# EAGLE design mach nguon doi (EAGLE 5.07)
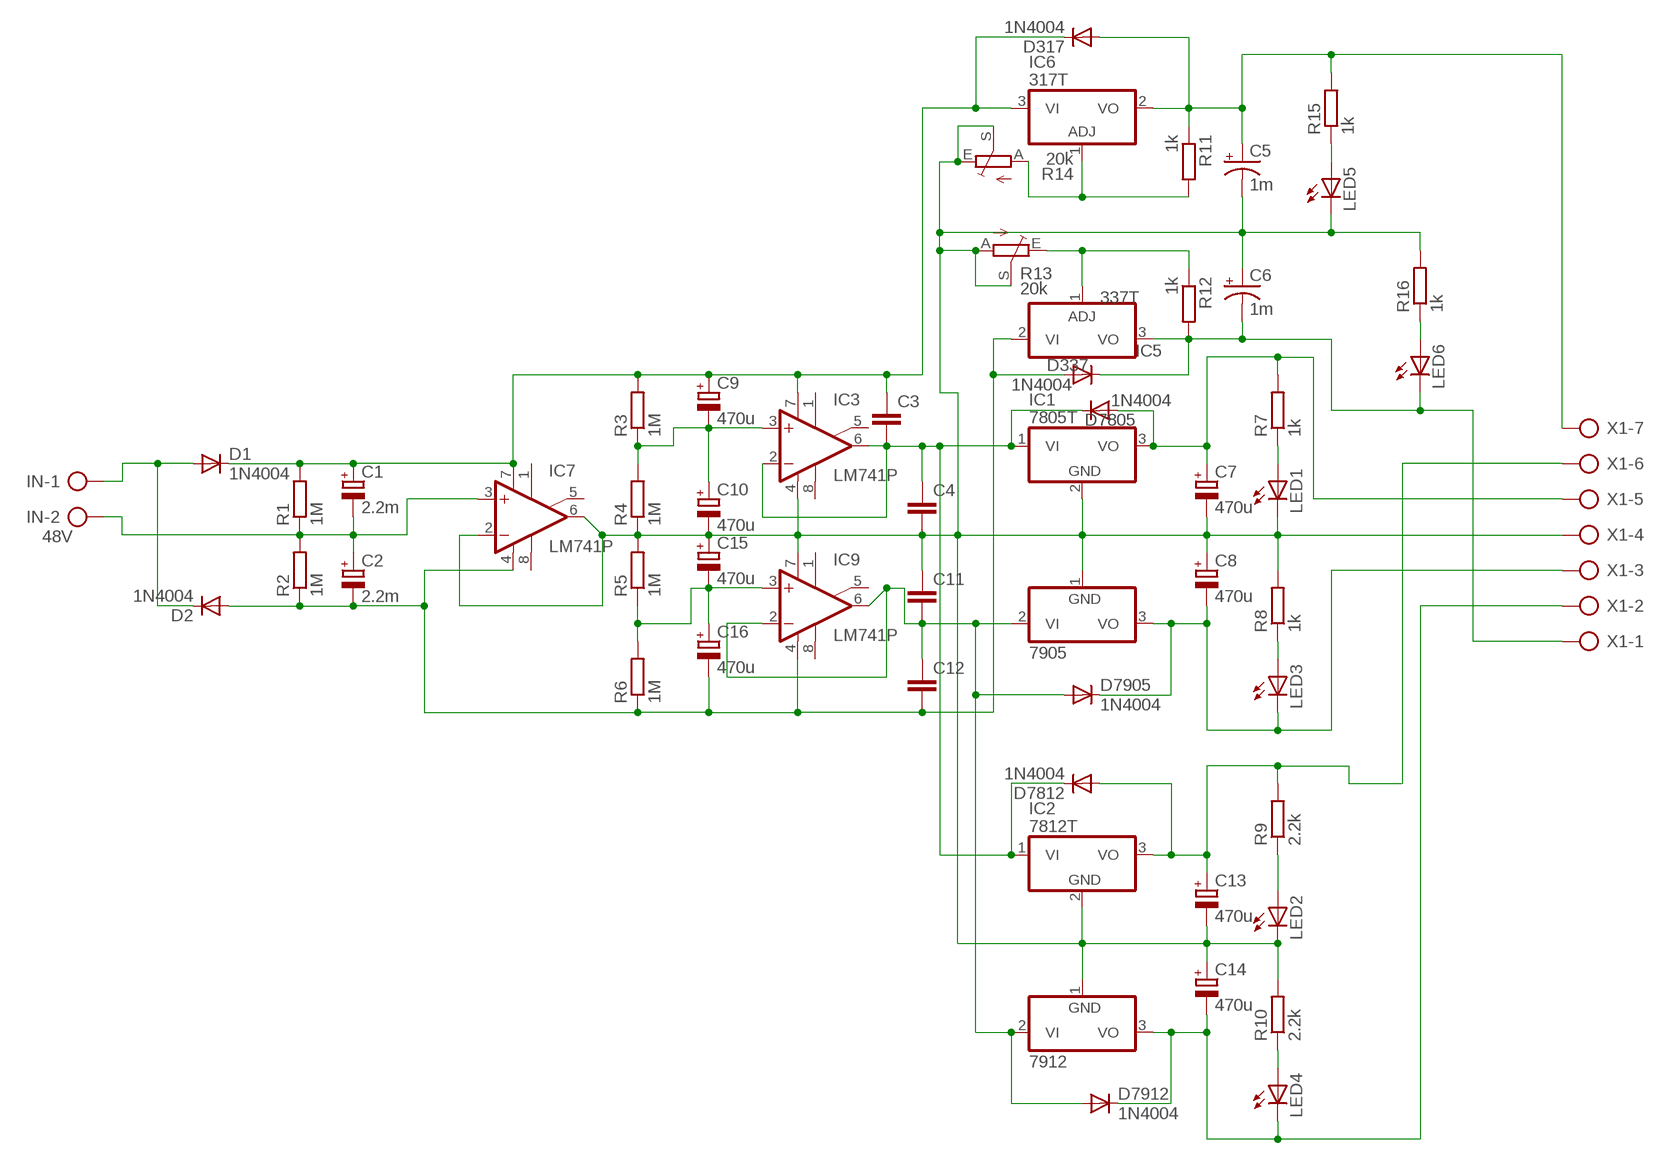
[diagram p0: schematic, sheet 1]

## Parts
7905  7905T  [TO220H]
7912  7912T  [TO220H]
C1  2.2m  CPOL-EUE7.5-18  [E7,5-18]
C2  2.2m  CPOL-EUE7.5-18  [E7,5-18]
C3  C-EU050-035X075  [C050-035X075]
C4  C-EU050-035X075  [C050-035X075]
C5  1m  CPOL-USE5-13  [E5-13]
C6  1m  CPOL-USE5-13  [E5-13]
C7  470u  CPOL-EUE5-8.5  [E5-8,5]
C8  470u  CPOL-EUE5-8.5  [E5-8,5]
C9  470u  CPOL-EUE5-8.5  [E5-8,5]
C10  470u  CPOL-EUE5-8.5  [E5-8,5]
C11  C-EU050-035X075  [C050-035X075]
C12  C-EU050-035X075  [C050-035X075]
C13  470u  CPOL-EUE5-8.5  [E5-8,5]
C14  470u  CPOL-EUE5-8.5  [E5-8,5]
C15  470u  CPOL-EUE5-8.5  [E5-8,5]
C16  470u  CPOL-EUE5-8.5  [E5-8,5]
D1  1N4004  [DO41-10]
D2  1N4004  [DO41-10]
D317  1N4004  [DO41-10]
D337  1N4004  [DO41-10]
D7805  1N4004  [DO41-10]
D7812  1N4004  [DO41-10]
D7905  1N4004  [DO41-10]
D7912  1N4004  [DO41-10]
IC1  7805T  [TO220H]
IC2  7812T  [TO220H]
IC3  LM741P  [DIL08]
IC5  337T  [TO220H]
IC6  317T  [TO220H]
IC7  LM741P  [DIL08]
IC9  LM741P  [DIL08]
IN  48V  AK500/2-H  [AK500/2-H]
LED1  LED5MM  [LED5MM]
LED2  LED5MM  [LED5MM]
LED3  LED5MM  [LED5MM]
LED4  LED5MM  [LED5MM]
LED5  LED5MM  [LED5MM]
LED6  LED5MM  [LED5MM]
R1  1M  R-EU_0207/5V  [0207/5V]
R2  1M  R-EU_0207/5V  [0207/5V]
R3  1M  R-EU_0207/5V  [0207/5V]
R4  1M  R-EU_0207/5V  [0207/5V]
R5  1M  R-EU_0207/5V  [0207/5V]
R6  1M  R-EU_0207/5V  [0207/5V]
R7  1k  R-EU_0207/5V  [0207/5V]
R8  1k  R-EU_0207/5V  [0207/5V]
R9  2.2k  R-EU_0207/5V  [0207/5V]
R10  2.2k  R-EU_0207/5V  [0207/5V]
R11  1k  R-EU_0207/5V  [0207/5V]
R12  1k  R-EU_0207/5V  [0207/5V]
R13  20k  TRIM_EU-RJ9W  [RJ9W]
R14  20k  TRIM_EU-RJ9W  [RJ9W]
R15  1k  R-EU_0207/5V  [0207/5V]
R16  1k  R-EU_0207/5V  [0207/5V]
X1  AK500/7-H  [AK500/7-H]

## Nets
N$1: C1.+ C3.1 C9.+ D1.C D317.C IC3.7(V+) IC6.3(VI) IC7.7(V+) R1.2 R3.2
N$3: D1.A D2.C IN.1
N$4: C6.- D337.C IC5.3(VO) LED6.K(C) R12.2 X1.1
N$5: 7905.2(VI) 7912.2(VI) C11.2 C12.1 D7905.A D7912.A IC9.2(-IN) IC9.6(OUT)
N$6: LED1.A R7.1
N$7: C9.- C10.+ IC3.3(+IN) R3.1 R4.2
N$8: C7.+ D7805.A IC1.3(VO) R7.2 X1.5
N$9: C5.+ D317.A IC6.2(VO) R11.1 R15.2 X1.7
N$10: 7905.3(VO) C8.- D7905.C LED3.K(C) X1.3
N$11: C15.- C16.+ IC9.3(+IN) R5.1 R6.2
N$12: C2.- C12.2 C16.- D2.A D337.A IC5.2(VI) IC7.4(V-) IC9.4(V-) R2.1 R6.1
N$13: IC6.1(ADJ) R11.2 R14.A
N$14: LED3.A R8.1
N$15: 7905.1(GND) 7912.1(GND) C4.2 C5.- C6.+ C7.- C8.+ C10.- C11.1 C13.- C14.+ C15.+ IC1.2(GND) IC2.2(GND) IC3.4(V-) IC7.2(-IN) IC7.6(OUT) IC9.7(V+) LED1.K(C) LED2.K(C) LED5.K(C) R4.1 R5.2 R8.2 R10.2 R13.A R13.S R14.E R14.S R16.2 X1.4
N$16: C13.+ D7812.A IC2.3(VO) R9.2 X1.6
N$18: C1.- C2.+ IC7.3(+IN) IN.2 R1.1 R2.2
N$19: LED2.A R9.1
N$20: LED4.A R10.1
N$22: C3.2 C4.1 D7805.C D7812.C IC1.1(VI) IC2.1(VI) IC3.2(-IN) IC3.6(OUT)
N$23: IC5.1(ADJ) R12.1 R13.E
N$25: LED5.A R15.1
N$26: 7912.3(VO) C14.- D7912.C LED4.K(C) X1.2
N$28: LED6.A R16.1
Unconnected: IC3.1(ON1) IC3.5(ON2) IC3.8(OPT) IC7.1(ON1) IC7.5(ON2) IC7.8(OPT) IC9.1(ON1) IC9.5(ON2) IC9.8(OPT)

## Library data of the parts
7905 7912 = linear:79*: Negative VOLTAGE REGULATOR
C1 C2 C7-C10 C13-C16 = resistor:CPOL-EU: POLARIZED CAPACITOR, European symbol
C3 C4 C11 C12 = rcl:C-EU: CAPACITOR, European symbol
C5 C6 = rcl:CPOL-US: POLARIZED CAPACITOR, American symbol
D1 D2 D317 D337 D7805 D7812 D7905 D7912 = diode:1N4004: DIODE general purpose rectifier, 1 A
IC1 IC2 = linear:78*: Positive VOLTAGE REGULATOR Source: http://cache.national.com/ds/LM/LM78L05.pdf http://www.fairchildsemi.com/ds/LM/LM7805.pdf
IC3 IC7 IC9 = linear:*741: OP AMP
IC5 = linear:*337: Negative VOLTAGE REGULATOR
IC6 = linear:*317: Positive VOLTAGE REGULATOR
IN = con-ptr500:AK500/2-H: CONNECTOR Aug. 2004 / PTR Meßtechnik: Die Bezeichnung der Serie AK505 wurde geändert. Es handelt sich hierbei um AK500 in horizontaler Ausführung.
LED1-LED6 = led:LED: LED OSRAM: - CHIPLED LG R971, LG N971, LY N971, LG Q971, LY Q971, LO R971, LY R971 LH N974, LH R974 LS Q976, LO Q976, LY Q976 LO Q996 - Hyper CHIPLED LW Q18S LB Q993, LB Q99A, LB R99A - SideLED LS A670, LO A670, LY A670, LG A670, LP A670 LB A673, LV A673, LT A673, LW A673 LH A674 LY A675 LS A676, LA A676, LO A676, LY A676, LW A676 LS A679, LY A679, LG A679 - Hyper Micro SIDELED® LS Y876, LA Y876, LO Y876, LY Y876 LT Y87S - SmartLED LW L88C, LW L88S LB L89C, LB L89S, LG L890 LS L89K, LO L89K, LY L89K LS L896, LA L896, LO L896, LY L896 - TOPLED LS T670, LO T670, LY T670, LG T670, LP T670 LSG T670, LSP T670, LSY T670, LOP T670, LYG T670 LG T671, LOG T671, LSG T671 LB T673, LV T673, LT T673, LW T673 LH T674 LS T676, LA T676, LO T676, LY T676, LB T676, LH T676, LSB T676, LW T676 LB T67C, LV T67C, LT T67C, LS T67K, LO T67K, LY T67K, LW E67C LS E67B, LA E67B, LO E67B, LY E67B, LB E67C, LV E67C, LT E67C LW T67C LS T679, LY T679, LG T679 LS T770, LO T770, LY T770, LG T770, LP T770 LB T773, LV T773, LT T773, LW T773 LH T774 LS E675, LA E675, LY E675, LS T675 LS T776, LA T776, LO T776, LY T776, LB T776 LHGB T686 LT T68C, LB T68C - Hyper Mini TOPLED® LB M676 - Mini TOPLED Santana® LG M470 LS M47K, LO M47K, LY M47K Source: http://www.osram.convergy.de LUXEON: - LUMILED® LXK2-PW12-R00, LXK2-PW12-S00, LXK2-PW14-U00, LXK2-PW14-V00 LXK2-PM12-R00, LXK2-PM12-S00, LXK2-PM14-U00 LXK2-PE12-Q00, LXK2-PE12-R00, LXK2-PE12-S00, LXK2-PE14-T00, LXK2-PE14-U00 LXK2-PB12-K00, LXK2-PB12-L00, LXK2-PB12-M00, LXK2-PB14-N00, LXK2-PB14-P00, LXK2-PB14-Q00 LXK2-PR12-L00, LXK2-PR12-M00, LXK2-PR14-Q00, LXK2-PR14-R00 LXK2-PD12-Q00, LXK2-PD12-R00, LXK2-PD12-S00 LXK2-PH12-R00, LXK2-PH12-S00 LXK2-PL12-P00, LXK2-PL12-Q00, LXK2-PL12-R00 Source: www.luxeon.com KINGBRIGHT: KA-3528ASYC Source: www.kingbright.com
R1-R12 R15 R16 = resistor:R-EU_: RESISTOR, European symbol
R13 R14 = pot:TRIM_EU-: POTENTIOMETER
X1 = con-ptr500:AK500/7-H: CONNECTOR Aug. 2004 / PTR Meßtechnik: Die Bezeichnung der Serie AK505 wurde geändert. Es handelt sich hierbei um AK500 in horizontaler Ausführung.

## Net classes
0 default: width 2 mm

## Board
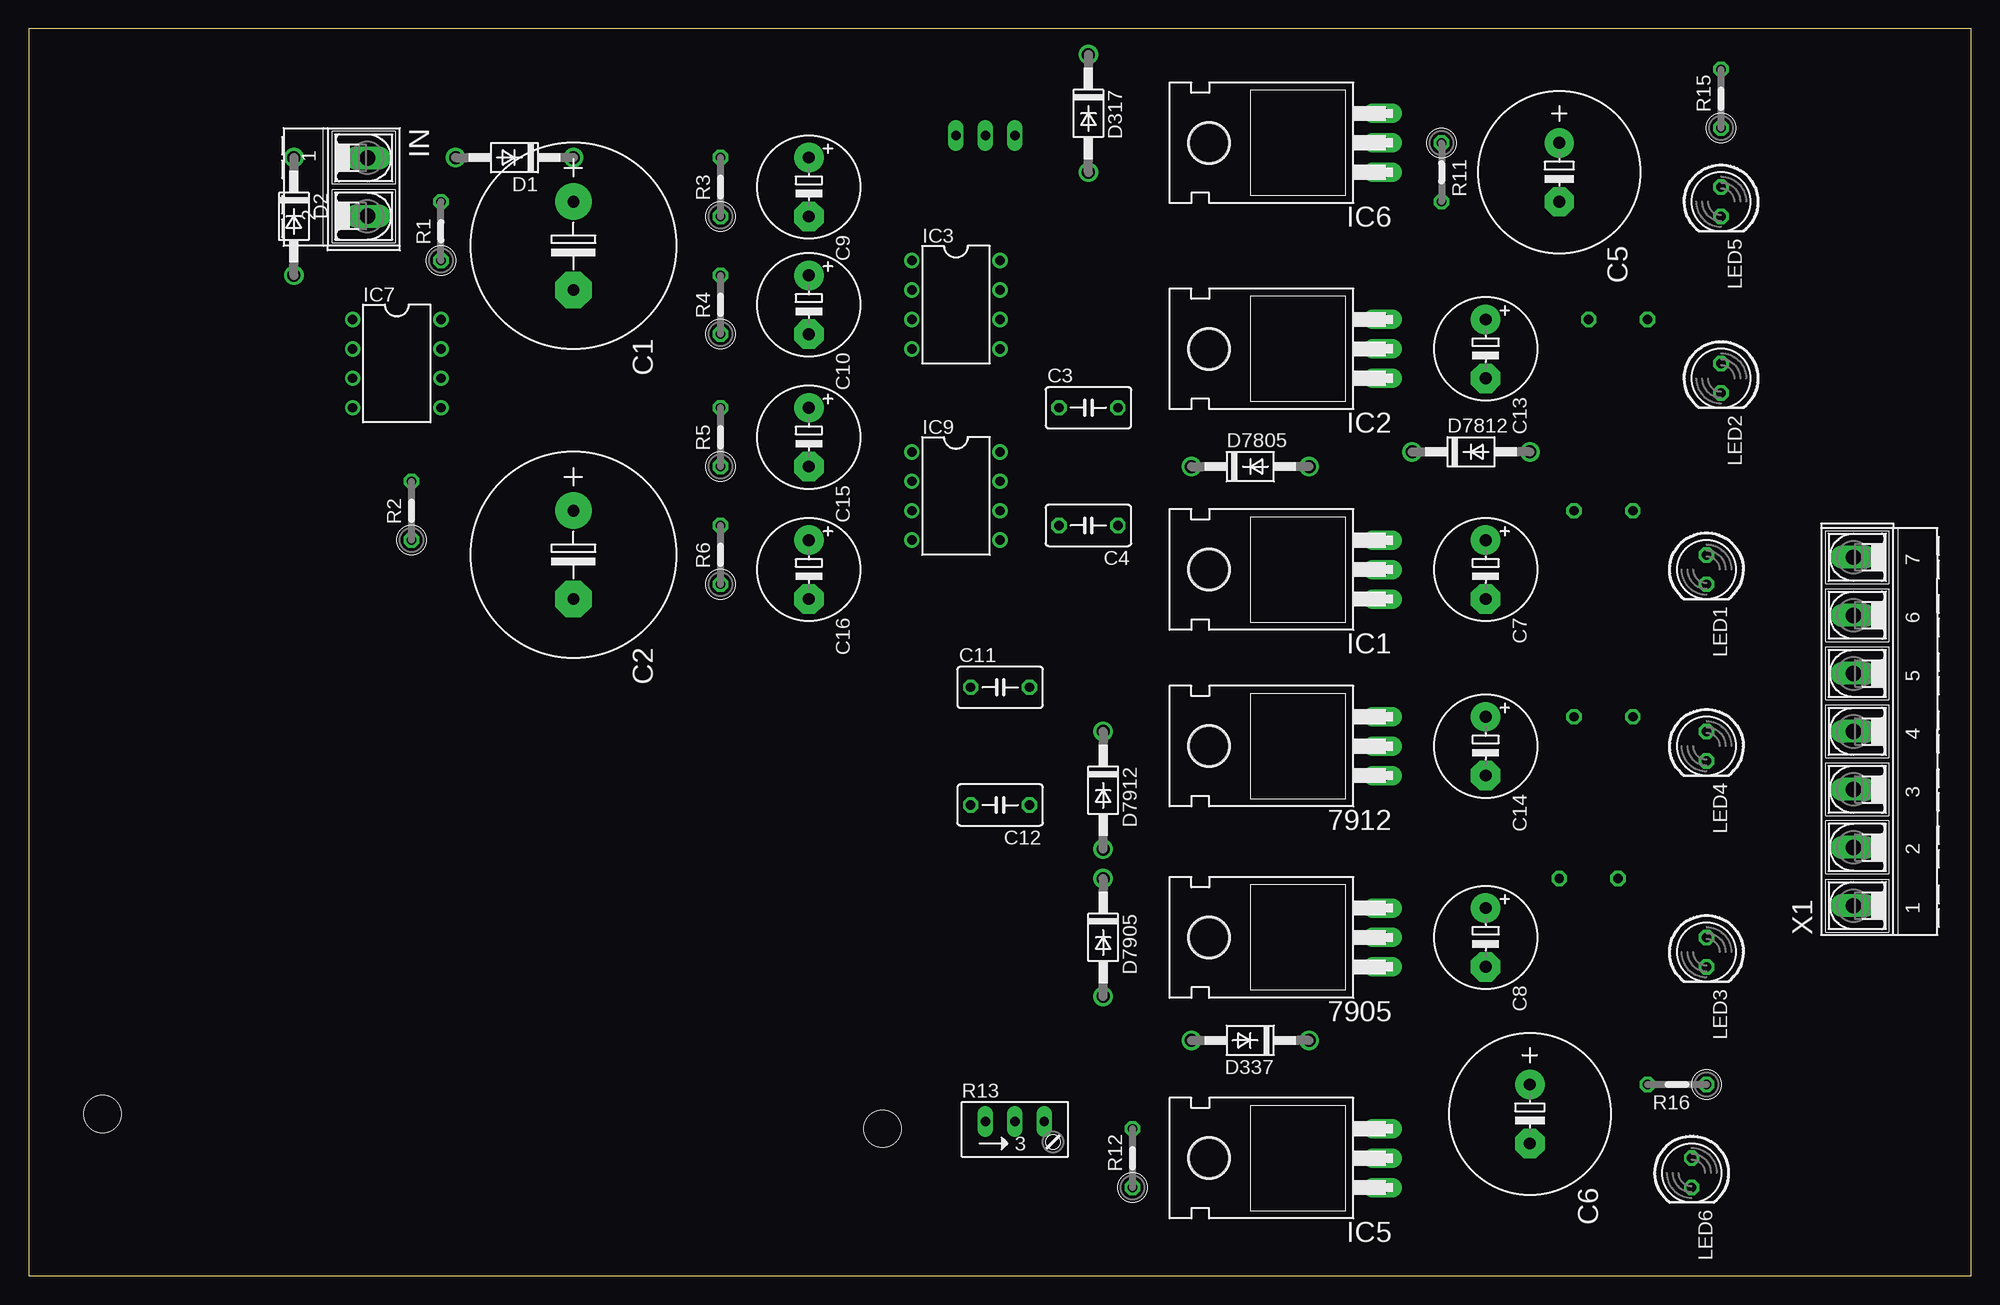
[diagram p1: board, top side]
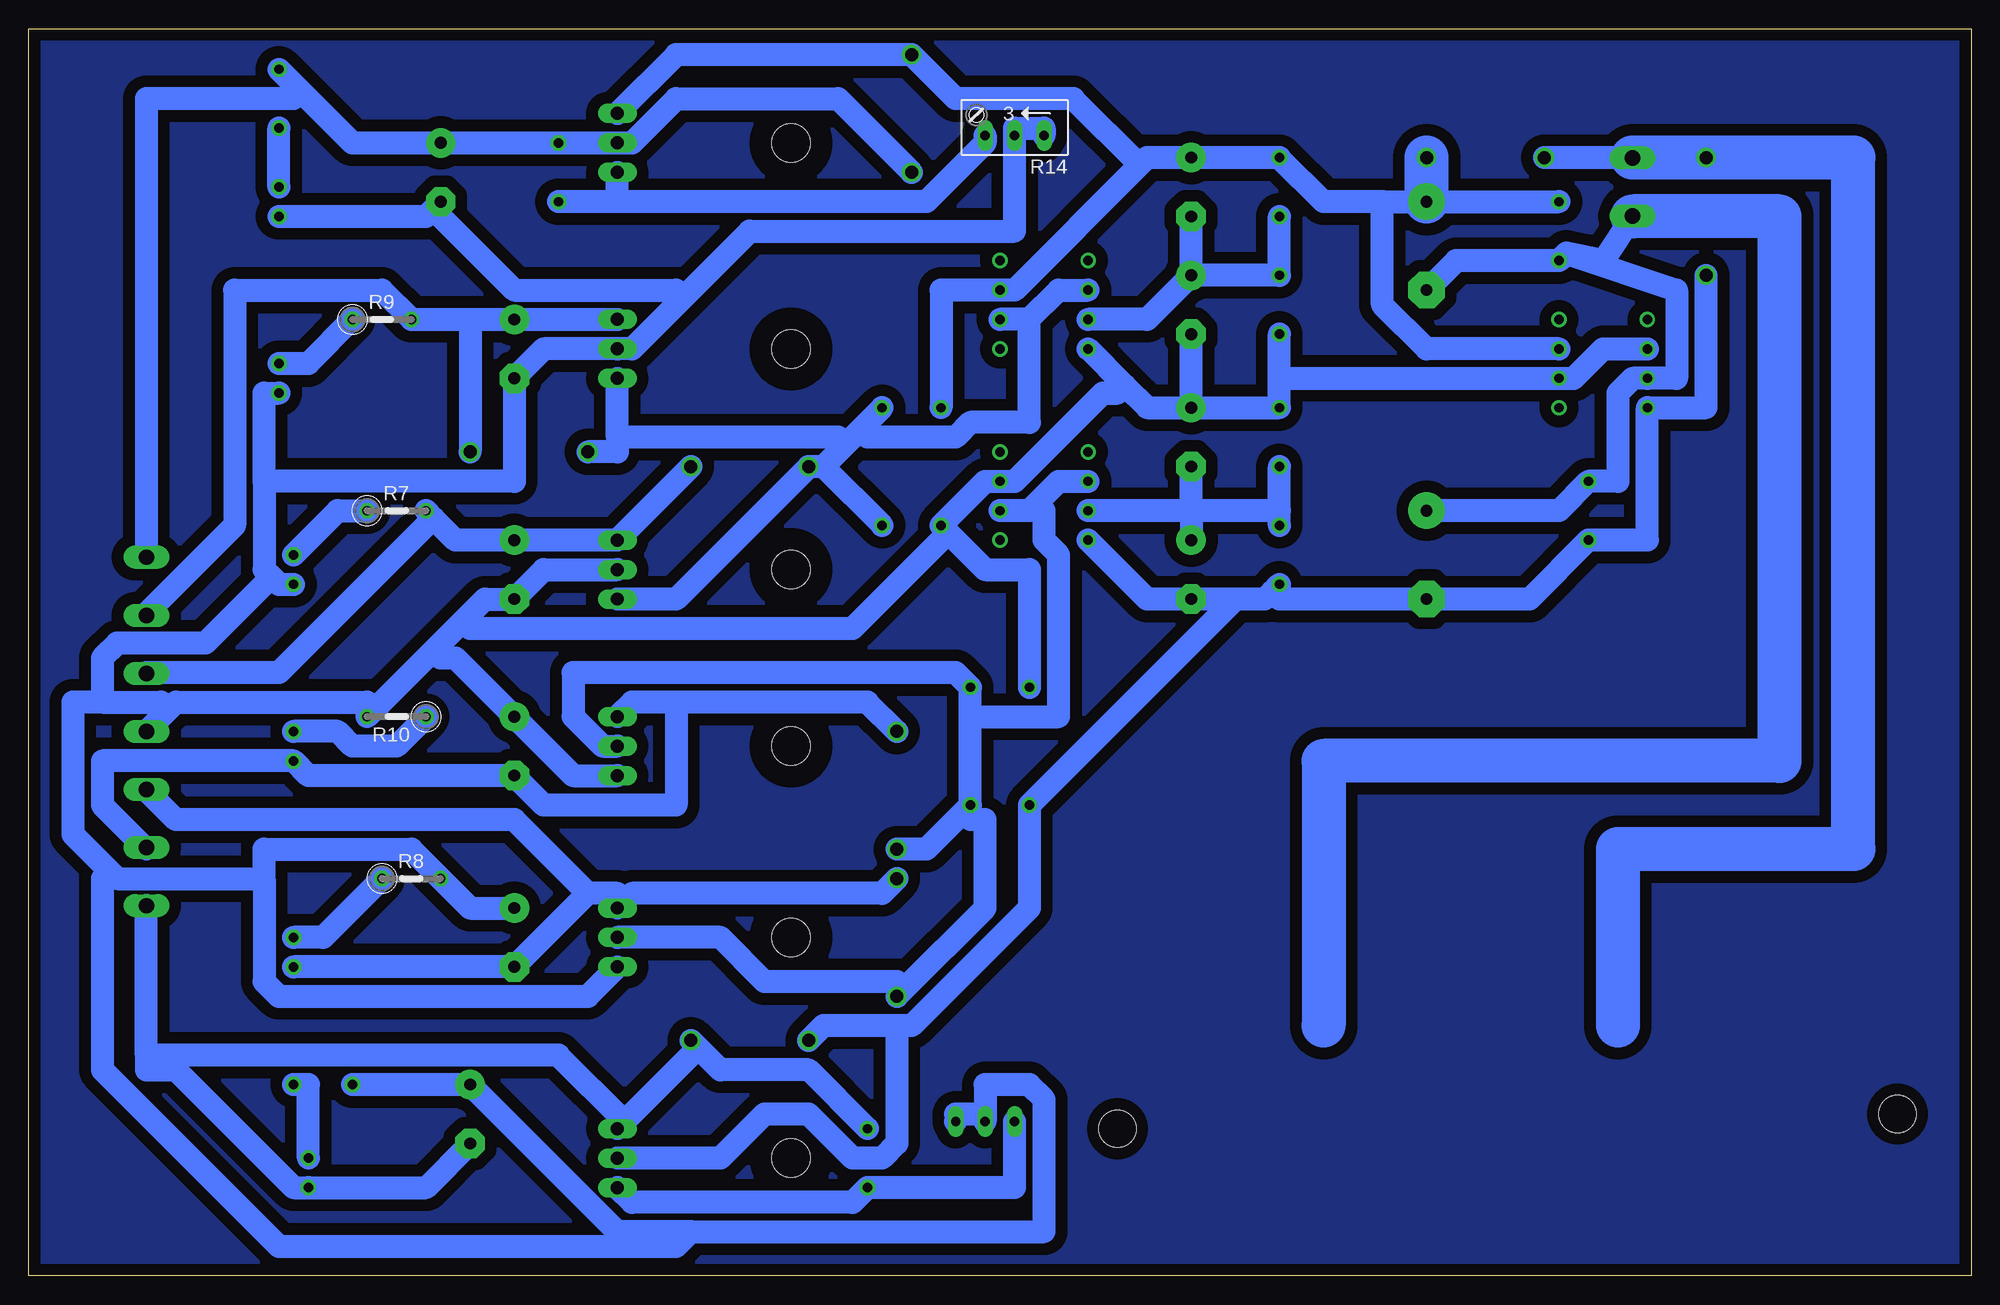
[diagram p2: board, bottom side, seen from below]

Size 167.62 x 107.62 mm. Coordinates in mm from the lower left corner, seen from the top.
Outline: 0,0 167.62,0 167.62,107.62 0,107.62 0,0
Copper layers (1*16): Top 0.035mm / dielectric 1.5mm / Bottom 0.035mm
Design rules "default": minimum track width 10mil, minimum drill 24mil, track to track 8mil, track to pad 8mil, pad to pad 8mil, via to via 8mil, smd to smd 8mil, copper to edge 40mil, drill to drill 8mil, minimum pad ring 10mil, minimum via ring 8mil, stop-mask expansion 4mil, vias tented up to drill 0mil, thermal gap 10mil
Holes 3.2 mm at 6.35,13.97 73.66,12.7

### Footprints (pad centres in the part's own frame; a part is rotated, then mirrored left to right if it is on the bottom)
TO220H = drill 1.118 long: 1 -2.54,-10.16; 2 0,-10.16; 3 2.54,-10.16 | hole 3.302: 0,4.826
E7,5-18 = drill 1.016 pad 3.15 round: + -3.81,0 | drill 1.016 pad 3.15 octagon: - 3.81,0
C050-035X075 = drill 0.813 octagon: 1 -2.54,0; 2 2.54,0
E5-13 = drill 1.016 pad 2.54 round: + -2.54,0 | drill 1.016 pad 2.54 octagon: - 2.54,0
E5-8,5 = drill 1.016 pad 2.54 round: + -2.54,0 | drill 1.016 pad 2.54 octagon: - 2.54,0
DO41-10 = drill 1.118 round: A 5.08,0; C -5.08,0
DIL08 = drill 0.813 pad 1.27 round: 1 -3.81,-3.81; 2 -1.27,-3.81; 3 1.27,-3.81; 4 3.81,-3.81; 5 3.81,3.81; 6 1.27,3.81; 7 -1.27,3.81; 8 -3.81,3.81
AK500/2-H = drill 1.321 long: 1 -2.515,0; 2 2.515,0
LED5MM = drill 0.813 octagon: A -1.27,0; K 1.27,0
0207/5V = drill 0.813 octagon: 1 -2.54,0; 2 2.54,0
RJ9W = drill 0.813 long: A 2.54,0.635; E -2.54,0.635; S 0,0.635
AK500/7-H = drill 1.321 long: 1 -15.037,0; 2 -10.008,0; 3 -5.004,0; 4 0,0; 5 5.004,0; 6 10.008,0; 7 15.037,0

### Placement (x,y rotation side)
7905  106.68,29.21 90 top
7912  106.68,45.72 90 top
C1  46.99,88.9 270 top
C2  46.99,62.23 270 top
C3  91.44,74.93 0 top
C4  91.44,64.77 180 top
C5  132.08,95.25 270 top
C6  129.54,13.97 270 top
C7  125.73,60.96 270 top
C8  125.73,29.21 270 top
C9  67.31,93.98 270 top
C10  67.31,83.82 270 top
C11  83.82,50.8 0 top
C12  83.82,40.64 180 top
C13  125.73,80.01 270 top
C14  125.73,45.72 270 top
C15  67.31,72.39 270 top
C16  67.31,60.96 270 top
D1  41.91,96.52 180 top
D2  22.86,91.44 270 top
D317  91.44,100.33 270 top
D337  105.41,20.32 180 top
D7805  105.41,69.85 0 top
D7812  124.46,71.12 0 top
D7905  92.71,29.21 270 top
D7912  92.71,41.91 270 top
IC1  106.68,60.96 90 top
IC2  106.68,80.01 90 top
IC3  80.01,83.82 270 top
IC5  106.68,10.16 90 top
IC6  106.68,97.79 90 top
IC7  31.75,78.74 270 top
IC9  80.01,67.31 270 top
IN  29.21,93.98 270 top
LED1  144.78,60.96 270 top
LED2  146.05,77.47 270 top
LED3  144.78,27.94 270 top
LED4  144.78,45.72 270 top
LED5  146.05,92.71 270 top
LED6  143.51,8.89 270 top
R1  35.56,90.17 90 top
R2  33.02,66.04 90 top
R3  59.69,93.98 90 top
R4  59.69,83.82 90 top
R5  59.69,72.39 90 top
R6  59.69,62.23 90 top
R7  135.89,66.04 0 bottom
R8  134.62,34.29 0 bottom
R9  137.16,82.55 0 bottom
R10  135.89,48.26 180 bottom
R11  121.92,95.25 270 top
R12  95.25,10.16 90 top
R13  85.09,12.7 0 top
R14  82.55,99.06 180 bottom
R15  146.05,101.6 90 top
R16  142.24,16.51 180 top
X1  157.48,46.99 90 top

### Tracks (layer width: path | path; a pad name or v marks a point on that pad's centre or on a via)
N$1
  Bottom 2: IC6.3 111.76,105.41 D317.C 87.63,101.6 77.47,101.6 71.75,95.89 | C3.1 88.9,85.09 IC3.7 82.55,85.09 71.75,95.89 | IC7.7 46.99,80.01 50.8,83.82 50.8,92.71 | 50.8,92.71 C1.+ R1.2 | 50.8,92.71 55.88,92.71 R3.2 C9.+ 71.12,96.52 71.75,95.89
  Bottom 3.81: C1.+ D1.C
N$2
  pour Bottom (isolate 1.016): 0,107.95 167.64,107.95 167.64,0 0,0
N$3
  Bottom 2: 29.21,96.52 D2.C | 29.21,96.52 D1.A | 29.21,96.52 IN.1
  Bottom 3.81: 29.21,96.52 10.16,96.52 10.16,36.83 30.48,36.83 30.48,21.59
N$4
  Bottom 2: R12.2 100.33,17.78 107.95,17.78 109.85,19.69 | 109.85,19.69 D337.C | 116.2,13.33 IC5.3 | 109.85,19.69 116.2,13.33 | C6.- 133.35,7.62 LED6.K 144.78,7.62 154.94,17.78 157.48,17.78 157.48,19.05 | 157.48,19.05 X1.1 | 157.48,19.05 121.92,19.05 116.2,13.33
N$5
  Bottom 2: IC9.2 78.74,68.58 80.64,66.67 | 80.64,66.67 81.28,66.04 IC9.6 | 86.99,40.01 90.17,36.83 D7912.A | 86.99,40.01 C12.1 86.36,48.26 | 86.36,48.26 C11.2 87.63,52.07 120.65,52.07 120.65,48.26 118.11,45.72 7912.2 | 92.07,24.77 85.09,31.75 85.09,39.37 86.36,39.37 86.99,40.01 | 92.07,24.77 D7905.A | 7905.2 107.95,29.21 104.14,25.4 92.71,25.4 92.07,24.77 | 86.36,48.26 78.74,48.26 78.74,62.23 80.01,63.5 80.01,66.04 80.64,66.67
N$6
  Bottom 2: LED1.A 140.97,66.04 R7.1
N$7
  Bottom 2: R3.1 R4.2 C10.+ | IC3.3 71.12,82.55 C10.+ | C10.+ C9.-
N$8
  Bottom 2: 132.72,65.41 130.81,63.5 C7.+ IC1.3 D7805.A | 132.72,65.41 R7.2 | X1.5 157.48,52.07 146.05,52.07 132.72,65.41
N$9
  Bottom 2: D317.A 97.79,101.6 111.76,101.6 115.57,97.79 IC6.2 R11.1 C5.+ 139.7,97.79 144.15,102.23 | 144.15,102.23 R15.2 | X1.7 157.48,101.6 144.78,101.6 144.15,102.23
N$10
  Bottom 2: LED3.K C8.- 119.38,33.02 | D7905.C 93.98,33.02 115.57,33.02 116.2,32.39 | 116.2,32.39 7905.3 | 119.38,33.02 125.73,39.37 154.94,39.37 157.48,41.91 X1.3 | 119.38,33.02 116.84,33.02 116.2,32.39
N$11
  Bottom 2: 59.69,66.04 R5.1 | R6.2 59.69,66.04 | 59.69,66.04 67.31,66.04 | 67.31,66.04 IC9.3 | 67.31,66.04 C16.+ | 67.31,66.04 C15.-
N$12
  Bottom 2: D2.A 22.86,74.93 IC7.4 27.94,63.5 R2.1 38.1,58.42 C2.- 59.69,58.42 60.32,59.06 | 60.32,59.06 60.96,58.42 63.5,58.42 | 60.32,59.06 R6.1 | 63.5,58.42 C16.- 71.12,58.42 IC9.4 | 63.5,58.42 C12.2 81.28,31.75 91.44,21.59 92.71,21.59 | D337.A 99.06,21.59 92.71,21.59 | IC5.2 107.95,10.16 104.14,13.97 100.33,13.97 96.52,10.16 93.98,10.16 92.71,11.43 92.71,21.59
N$13
  Bottom 2: 116.84,92.71 R11.2 | 116.84,92.71 90.17,92.71 85.09,97.79 R14.A | 116.84,92.71 IC6.1
N$14
  Bottom 2: R8.1 142.24,29.21 LED3.A
N$15
  Bottom 2: C11.1 81.28,60.96 85.09,60.96 88.27,64.14 | 88.27,64.14 C4.2 85.09,68.58 IC9.7 82.55,68.58 74.93,76.2 73.66,76.2 73.02,76.84 | IC7.2 31.75,80.01 34.29,77.47 IC7.6 59.69,77.47 | 59.69,77.47 R4.1 | 59.69,77.47 R5.2 C15.+ | 73.02,76.84 71.12,74.93 C15.+ | 73.02,76.84 IC3.4 | C15.+ C10.- | LED5.K 133.35,91.44 132.72,92.08 | 132.72,92.08 C5.- | R14.E 80.01,99.06 82.55,99.06 R14.S 82.55,90.17 105.41,90.17 111.12,84.45 | 111.12,84.45 115.57,80.01 IC2.2 123.19,80.01 C13.- 125.73,68.58 147.32,68.58 | 132.72,92.08 125.73,85.09 111.76,85.09 111.12,84.45 | 85.09,13.97 87.63,13.97 R13.A | R16.2 C6.+ 116.84,3.81 110.49,3.81 | 85.09,13.97 85.09,16.51 81.28,16.51 80.01,15.24 80.01,3.81 110.49,3.81 | 85.09,13.97 R13.S | C8.+ 129.54,31.75 R8.2 134.62,36.83 147.32,36.83 147.32,34.29 | 7905.1 119.38,24.13 146.05,24.13 147.32,25.4 147.32,34.29 | 7912.1 120.65,43.18 C14.+ 130.81,53.34 132.08,53.34 132.72,53.98 | LED1.K 146.05,59.69 146.69,60.33 | 146.69,60.33 147.32,60.96 147.32,68.58 | 147.32,68.58 147.32,76.2 LED2.K | 130.18,56.52 128.27,58.42 C7.- 123.19,60.96 IC1.2 | 132.72,53.98 130.18,56.52 | 137.8,48.9 132.72,53.98 | 137.8,48.9 R10.2 | 155.58,48.9 154.94,49.53 138.43,49.53 137.8,48.9 | 155.58,48.9 X1.4 | 161.29,49.53 161.29,53.34 160.02,54.61 152.4,54.61 146.69,60.33 | 161.29,49.53 156.21,49.53 155.58,48.9 | 147.32,34.29 160.02,34.29 160.66,34.93 | 160.66,34.93 163.83,38.1 163.83,49.53 161.29,49.53 | 110.49,3.81 111.76,2.54 146.05,2.54 161.29,17.78 161.29,34.29 160.66,34.93 | 88.27,64.14 96.52,55.88 129.54,55.88 130.18,56.52
N$16
  Bottom 2: 129.54,82.55 C13.+ IC2.3 | 129.54,82.55 R9.2 137.16,85.09 149.86,85.09 149.86,64.77 157.48,57.15 X1.6 | 129.54,82.55 D7812.A
N$18
  Bottom 2: 34.92,88.27 R1.1 44.45,87.63 C1.- | IN.2 29.21,91.44 31.75,87.63 34.92,88.27 | C2.+ 35.56,66.04 R2.2 30.48,68.58 30.48,76.2 29.21,77.47 IC7.3 25.4,77.47 25.4,85.09 34.92,88.27
  Bottom 3.81: 29.21,91.44 16.51,91.44 16.51,44.45 55.88,44.45 55.88,21.59
N$19
  Bottom 2: R9.1 143.51,78.74 LED2.A
N$20
  Bottom 2: LED4.A 140.97,46.99 139.7,45.72 135.89,45.72 R10.1
N$22
  Bottom 2: 116.84,72.39 116.84,71.12 D7812.C | 116.84,72.39 IC2.1 | IC3.2 78.74,85.09 81.28,82.55 | 81.28,82.55 IC3.6 | 99.06,69.85 C4.1 | 99.06,69.85 D7805.C 111.76,58.42 IC1.1 | 97.16,71.75 99.06,69.85 | 95.88,73.03 97.16,71.75 | 95.88,73.03 C3.2 | 81.28,82.55 81.28,73.66 86.36,73.66 87.63,72.39 95.25,72.39 95.88,73.03 | 116.84,72.39 97.79,72.39 97.16,71.75
N$23
  Bottom 2: IC5.1 115.57,6.35 96.52,6.35 R12.1 82.55,7.62 R13.E
N$25
  Bottom 2: LED5.A R15.1
N$26
  Bottom 2: D7912.C 95.25,49.53 111.76,49.53 | 111.76,49.53 115.57,49.53 7912.3 | X1.2 157.48,36.83 161.29,40.64 161.29,44.45 LED4.K 143.51,43.18 C14.- 123.19,40.64 111.76,40.64 111.76,49.53
N$28
  Bottom 2: LED6.A 143.51,16.51 R16.1